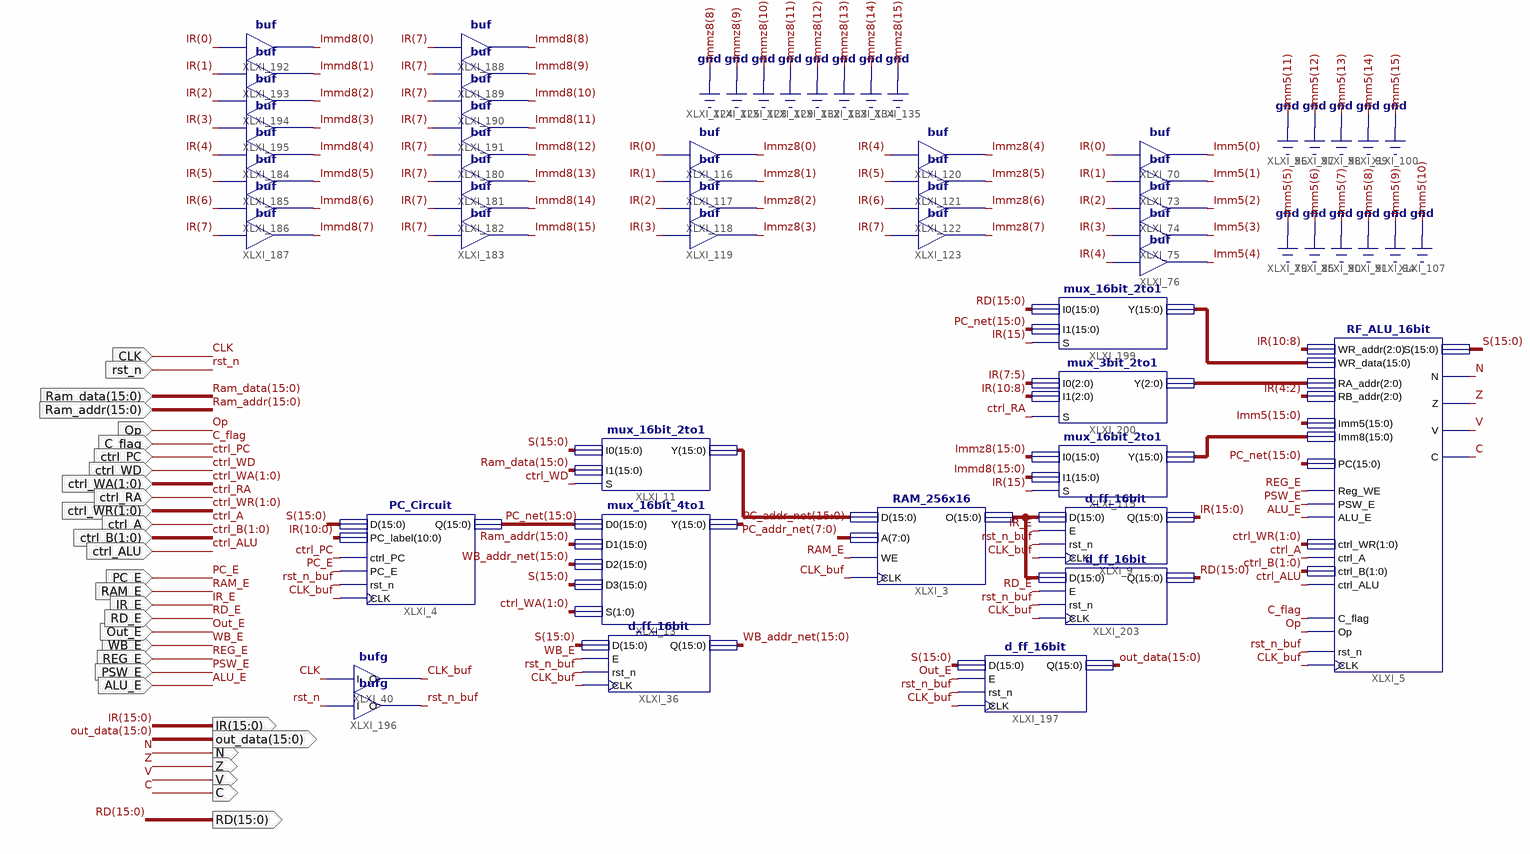
[diagram p0: schematic sheet 1]
// Xilinx ISE schematic Datapath_16bit.sch (virtex6) as structural Verilog: 43 symbols, 30 ports
module Datapath_16bit (
  input  [15:0] Ram_data,
  input  ctrl_WD,
  input  [15:0] Ram_addr,
  input  ctrl_PC,
  input  PC_E,
  input  WB_E,
  input  CLK,
  input  IR_E,
  input  [1:0] ctrl_WA,
  input  RAM_E,
  input  C_flag,
  input  Op,
  input  rst_n,
  input  Out_E,
  input  REG_E,
  input  PSW_E,
  input  [1:0] ctrl_WR,
  input  ctrl_A,
  input  [1:0] ctrl_B,
  input  ALU_E,
  input  ctrl_ALU,
  input  ctrl_RA,
  input  RD_E,
  output [15:0] IR,
  output [15:0] out_data,
  output N,
  output Z,
  output V,
  output C,
  output [15:0] RD
);

  wire CLK_buf, rst_n_buf;
  wire [2:0] XLXN_773;
  wire [4:0] Imm5;
  wire [7:0] Immz8;
  wire [15:0] Immd8, PC_addr_net, PC_net, S, WB_addr_net, XLXN_5, XLXN_125, XLXN_529, XLXN_563;

  mux_16bit_4to1 XLXI_13 (.S(ctrl_WA), .D3(S), .D2(WB_addr_net), .D1(Ram_addr), .D0(PC_net), .Y(PC_addr_net));
  mux_16bit_2to1 XLXI_11 (.S(ctrl_WD), .I1(Ram_data), .I0(S), .Y(XLXN_5));
  PC_Circuit XLXI_4 (
    .Q(PC_net), .CLK(CLK_buf), .rst_n(rst_n_buf), .PC_E(PC_E), .ctrl_PC(ctrl_PC), .D(S), .PC_label(IR[10:0]));
  d_ff_16bit XLXI_36 (.E(WB_E), .D(S), .Q(WB_addr_net), .CLK(CLK_buf), .rst_n(rst_n_buf));
  bufg XLXI_40 (.I(CLK), .O(CLK_buf));
  RAM_256x16 XLXI_3 (.O(XLXN_125), .CLK(CLK_buf), .A(PC_addr_net[7:0]), .D(XLXN_5), .WE(RAM_E));
  bufg XLXI_196 (.I(rst_n), .O(rst_n_buf));
  buf XLXI_70 (Imm5[0], IR[0]);
  buf XLXI_73 (Imm5[1], IR[1]);
  buf XLXI_74 (Imm5[2], IR[2]);
  buf XLXI_75 (Imm5[3], IR[3]);
  buf XLXI_76 (Imm5[4], IR[4]);
  buf XLXI_116 (Immz8[0], IR[0]);
  buf XLXI_117 (Immz8[1], IR[1]);
  buf XLXI_118 (Immz8[2], IR[2]);
  buf XLXI_119 (Immz8[3], IR[3]);
  buf XLXI_120 (Immz8[4], IR[4]);
  buf XLXI_121 (Immz8[5], IR[5]);
  buf XLXI_122 (Immz8[6], IR[6]);
  buf XLXI_123 (Immz8[7], IR[7]);
  buf XLXI_180 (Immd8[12], IR[7]);
  buf XLXI_181 (Immd8[13], IR[7]);
  buf XLXI_182 (Immd8[14], IR[7]);
  buf XLXI_183 (Immd8[15], IR[7]);
  buf XLXI_188 (Immd8[8], IR[7]);
  buf XLXI_189 (Immd8[9], IR[7]);
  buf XLXI_190 (Immd8[10], IR[7]);
  buf XLXI_191 (Immd8[11], IR[7]);
  buf XLXI_184 (Immd8[4], IR[4]);
  buf XLXI_185 (Immd8[5], IR[5]);
  buf XLXI_186 (Immd8[6], IR[6]);
  buf XLXI_187 (Immd8[7], IR[7]);
  buf XLXI_192 (Immd8[0], IR[0]);
  buf XLXI_193 (Immd8[1], IR[1]);
  buf XLXI_194 (Immd8[2], IR[2]);
  buf XLXI_195 (Immd8[3], IR[3]);
  RF_ALU_16bit XLXI_5 (
    .CLK(CLK_buf), .rst_n(rst_n_buf), .RB_addr(IR[4:2]), .RA_addr(XLXN_773), .WR_addr(IR[10:8]),
    .Reg_WE(REG_E), .C_flag(C_flag), .Op(Op), .WR_data(XLXN_563), .PC(PC_net), .ctrl_A(ctrl_A),
    .Imm5({{11{1'b0}}, Imm5}), .Imm8(XLXN_529), .ctrl_B(ctrl_B), .PSW_E(PSW_E), .ctrl_WR(ctrl_WR), .S(S),
    .N(N), .Z(Z), .V(V), .C(C), .ctrl_ALU(ctrl_ALU), .ALU_E(ALU_E));
  mux_16bit_2to1 XLXI_115 (.S(IR[15]), .I1(Immd8), .I0({{8{1'b0}}, Immz8}), .Y(XLXN_529));
  mux_3bit_2to1 XLXI_200 (.I1(IR[10:8]), .S(ctrl_RA), .I0(IR[7:5]), .Y(XLXN_773));
  d_ff_16bit XLXI_9 (.E(IR_E), .D(XLXN_125), .Q(IR), .CLK(CLK_buf), .rst_n(rst_n_buf));
  d_ff_16bit XLXI_197 (.E(Out_E), .D(S), .Q(out_data), .CLK(CLK_buf), .rst_n(rst_n_buf));
  d_ff_16bit XLXI_203 (.E(RD_E), .D(XLXN_125), .Q(RD), .CLK(CLK_buf), .rst_n(rst_n_buf));
  mux_16bit_2to1 XLXI_199 (.S(IR[15]), .I1(PC_net), .I0(RD), .Y(XLXN_563));
endmodule
